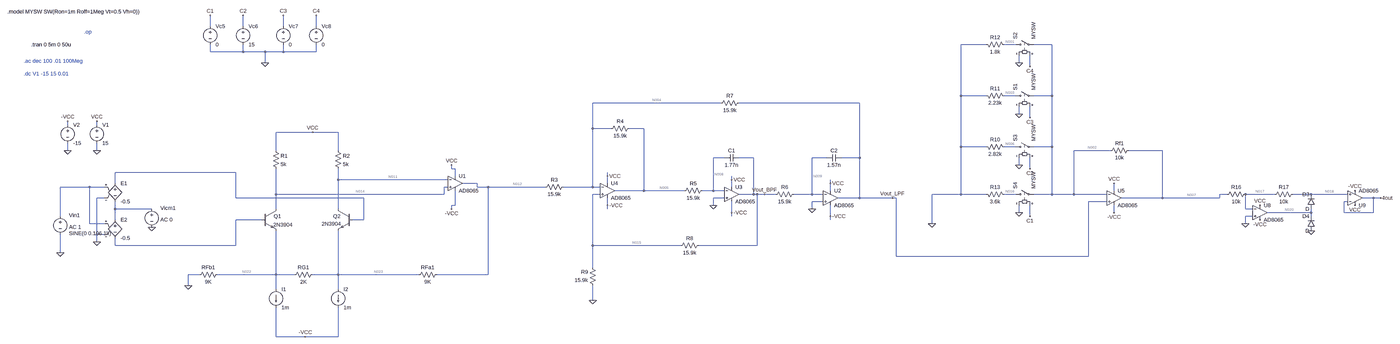
[diagram p0: schematic fullproiect.asc, whole sheet]
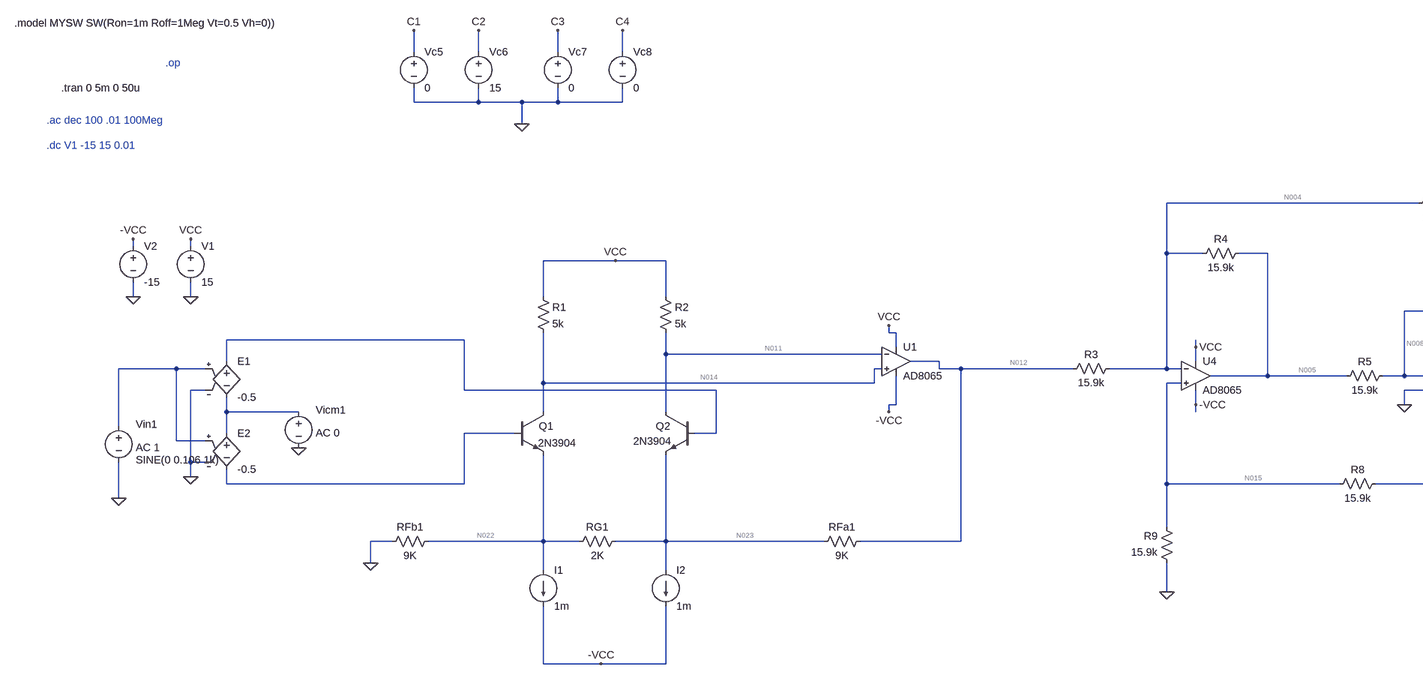
[diagram p1: schematic fullproiect.asc, part, row 1 of 1, column 1 of 2]
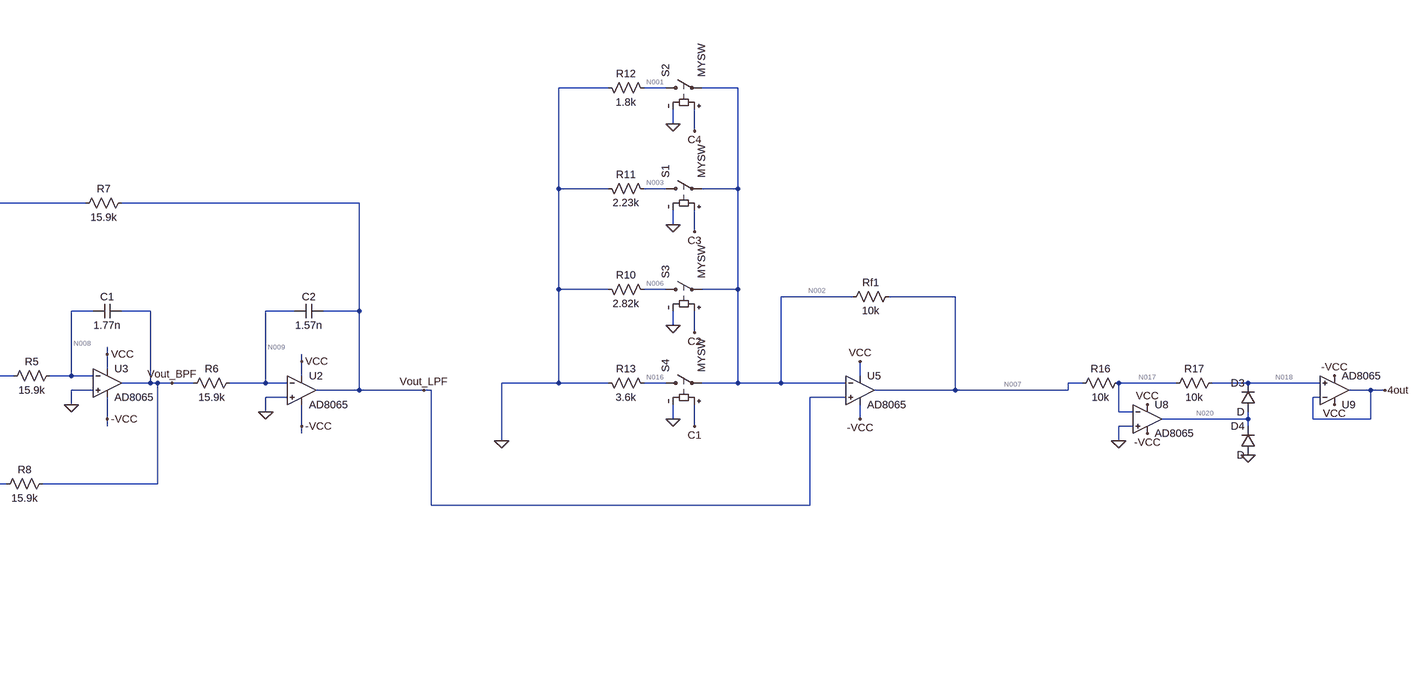
[diagram p2: schematic fullproiect.asc, part, row 1 of 1, column 2 of 2]
fullproiect.asc, the LTspice schematic file:
Version 4
SHEET 1 5496 1652
WIRE -208 -816 -208 -864
WIRE -64 -816 -64 -864
WIRE 112 -816 112 -864
WIRE 256 -816 256 -864
WIRE 3504 -736 3376 -736
WIRE 3632 -736 3584 -736
WIRE 3792 -736 3712 -736
WIRE -208 -704 -208 -736
WIRE -64 -704 -64 -736
WIRE -64 -704 -208 -704
WIRE 32 -704 -64 -704
WIRE 112 -704 112 -736
WIRE 112 -704 32 -704
WIRE 256 -704 256 -736
WIRE 256 -704 112 -704
WIRE 32 -656 32 -704
WIRE 3648 -656 3648 -688
WIRE 3696 -640 3696 -688
WIRE 3376 -512 3376 -736
WIRE 3504 -512 3376 -512
WIRE 3632 -512 3584 -512
WIRE 3792 -512 3792 -736
WIRE 3792 -512 3712 -512
WIRE 2176 -480 1616 -480
WIRE 2784 -480 2256 -480
WIRE 3648 -432 3648 -464
WIRE 3696 -416 3696 -464
WIRE -832 -384 -832 -400
WIRE -704 -384 -704 -400
WIRE 1616 -368 1616 -480
WIRE 1696 -368 1616 -368
WIRE 1840 -368 1776 -368
WIRE 240 -352 80 -352
WIRE 352 -352 240 -352
WIRE 3376 -288 3376 -512
WIRE 3504 -288 3376 -288
WIRE 3632 -288 3584 -288
WIRE 3792 -288 3792 -512
WIRE 3792 -288 3712 -288
WIRE -832 -272 -832 -304
WIRE -704 -272 -704 -304
WIRE 80 -272 80 -352
WIRE 352 -272 352 -352
WIRE 4048 -272 3888 -272
WIRE 4304 -272 4128 -272
WIRE 2192 -240 2144 -240
WIRE 2320 -240 2256 -240
WIRE 2640 -240 2576 -240
WIRE 2784 -240 2784 -480
WIRE 2784 -240 2704 -240
WIRE 3648 -208 3648 -240
WIRE 848 -192 848 -208
WIRE 864 -192 848 -192
WIRE 3696 -192 3696 -240
WIRE -96 -176 -624 -176
WIRE 864 -160 864 -192
WIRE 1680 -160 1680 -176
WIRE 352 -144 352 -192
WIRE 832 -144 352 -144
WIRE 2224 -144 2224 -160
WIRE -624 -128 -624 -176
WIRE 960 -128 896 -128
WIRE 1680 -128 1680 -160
WIRE 2656 -128 2656 -144
WIRE -736 -112 -864 -112
WIRE -672 -112 -736 -112
WIRE 832 -112 816 -112
WIRE 960 -112 960 -128
WIRE 1008 -112 960 -112
WIRE 1408 -112 1008 -112
WIRE 1616 -112 1616 -368
WIRE 1616 -112 1488 -112
WIRE 1648 -112 1616 -112
WIRE 2224 -112 2224 -144
WIRE 1840 -96 1840 -368
WIRE 1840 -96 1712 -96
WIRE 2016 -96 1840 -96
WIRE 2144 -96 2144 -240
WIRE 2144 -96 2096 -96
WIRE 2192 -96 2144 -96
WIRE 2656 -96 2656 -128
WIRE 4064 -96 4064 -128
WIRE 80 -80 80 -192
WIRE 816 -80 816 -112
WIRE 816 -80 80 -80
WIRE 1648 -80 1616 -80
WIRE 2320 -80 2320 -240
WIRE 2320 -80 2256 -80
WIRE 2336 -80 2320 -80
WIRE 2368 -80 2336 -80
WIRE 2416 -80 2368 -80
WIRE 2576 -80 2576 -240
WIRE 2576 -80 2496 -80
WIRE 2624 -80 2576 -80
WIRE 3376 -80 3376 -288
WIRE 3376 -80 3232 -80
WIRE 3504 -80 3376 -80
WIRE 3632 -80 3584 -80
WIRE 3792 -80 3792 -288
WIRE 3792 -80 3712 -80
WIRE 3888 -80 3888 -272
WIRE 3888 -80 3792 -80
WIRE 4032 -80 3888 -80
WIRE 4752 -80 4720 -80
WIRE 4960 -80 4832 -80
WIRE 5120 -80 5040 -80
WIRE 5280 -80 5120 -80
WIRE -672 -64 -704 -64
WIRE -96 -64 -96 -176
WIRE 464 -64 -96 -64
WIRE 2192 -64 2144 -64
WIRE 2784 -64 2784 -240
WIRE 2784 -64 2688 -64
WIRE 2928 -64 2784 -64
WIRE 2944 -64 2928 -64
WIRE 4304 -64 4304 -272
WIRE 4304 -64 4096 -64
WIRE 4720 -64 4720 -80
WIRE 4720 -64 4304 -64
WIRE 5392 -64 5344 -64
WIRE 5424 -64 5392 -64
WIRE 2624 -48 2576 -48
WIRE 4032 -48 3952 -48
WIRE 5280 -48 5264 -48
WIRE 864 -32 864 -96
WIRE 864 -32 848 -32
WIRE 1680 -32 1680 -64
WIRE 2144 -32 2144 -64
WIRE -624 -16 -624 -48
WIRE -464 -16 -624 -16
WIRE 80 -16 80 -80
WIRE 352 -16 352 -144
WIRE 848 -16 848 -32
WIRE 1680 -16 1680 -32
WIRE 2576 -16 2576 -48
WIRE 4832 -16 4832 -80
WIRE 4864 -16 4832 -16
WIRE 2224 0 2224 -48
WIRE 3648 0 3648 -32
WIRE 4064 0 4064 -32
WIRE 5120 0 5120 -16
WIRE 5120 0 4928 0
WIRE 5264 0 5264 -48
WIRE 5392 0 5392 -64
WIRE 5392 0 5264 0
WIRE -864 16 -864 -112
WIRE 2224 16 2224 0
WIRE 2656 16 2656 -32
WIRE 3696 16 3696 -32
WIRE 4864 16 4832 16
WIRE 5120 16 5120 0
WIRE -624 32 -624 -16
WIRE 16 32 -96 32
WIRE 464 32 464 -64
WIRE 464 32 416 32
WIRE 2656 32 2656 16
WIRE -736 48 -736 -112
WIRE -672 48 -736 48
WIRE 3232 48 3232 -80
WIRE 4832 48 4832 16
WIRE -704 96 -704 -64
WIRE -672 96 -704 96
WIRE -704 128 -704 96
WIRE -624 144 -624 112
WIRE -96 144 -96 32
WIRE -96 144 -624 144
WIRE 1616 144 1616 -80
WIRE 2000 144 1616 144
WIRE 2336 144 2336 -80
WIRE 2336 144 2080 144
WIRE -864 176 -864 96
WIRE 2944 192 2944 -64
WIRE 3952 192 3952 -48
WIRE 3952 192 2944 192
WIRE 1616 240 1616 144
WIRE -256 272 -304 272
WIRE 80 272 80 80
WIRE 80 272 -176 272
WIRE 160 272 80 272
WIRE 352 272 352 80
WIRE 352 272 240 272
WIRE 704 272 352 272
WIRE 1008 272 1008 -112
WIRE 1008 272 784 272
WIRE -304 320 -304 272
WIRE 80 336 80 272
WIRE 352 336 352 272
WIRE 1616 384 1616 320
WIRE 80 544 80 416
WIRE 208 544 80 544
WIRE 352 544 352 416
WIRE 352 544 208 544
FLAG -704 -272 0
FLAG -704 -400 VCC
FLAG -832 -272 0
FLAG -832 -400 -VCC
FLAG 848 -208 VCC
FLAG 848 -16 -VCC
FLAG 240 -352 VCC
FLAG -304 320 0
FLAG 208 544 -VCC
FLAG -864 176 0
FLAG -704 128 0
FLAG -464 64 0
FLAG 1616 384 0
FLAG 2144 -32 0
FLAG 2576 -16 0
FLAG 1680 -160 VCC
FLAG 2224 -144 VCC
FLAG 2656 -128 VCC
FLAG 1680 -32 -VCC
FLAG 2224 0 -VCC
FLAG 2656 16 -VCC
FLAG 2928 -64 Vout_LPF
FLAG 2368 -80 Vout_BPF
FLAG 3232 48 0
FLAG 4064 0 -VCC
FLAG 4064 -128 VCC
FLAG 3648 -656 0
FLAG 3648 -432 0
FLAG 3648 -208 0
FLAG 3648 0 0
FLAG 3696 16 C1
FLAG 3696 -192 C2
FLAG 3696 -416 C3
FLAG 3696 -640 C4
FLAG -208 -864 C1
FLAG -64 -864 C2
FLAG 112 -864 C3
FLAG 256 -864 C4
FLAG 32 -656 0
FLAG 4832 48 0
FLAG 5120 80 0
FLAG 4896 -32 VCC
FLAG 5312 -96 -VCC
FLAG 4896 32 -VCC
FLAG 5312 -32 VCC
FLAG 5424 -64 4out
DATAFLAG 80 -144 ""
DATAFLAG 352 -160 ""
DATAFLAG 80 224 ""
DATAFLAG 352 192 ""
DATAFLAG 1008 0 ""
SYMBOL voltage -704 -400 R0
WINDOW 123 0 0 Left 2
WINDOW 39 0 0 Left 2
SYMATTR InstName V1
SYMATTR Value 15
SYMBOL voltage -832 -400 R0
WINDOW 123 0 0 Left 2
WINDOW 39 0 0 Left 2
SYMATTR InstName V2
SYMATTR Value -15
SYMBOL npn 16 -16 R0
WINDOW 0 54 32 Left 2
WINDOW 3 52 69 Left 2
SYMATTR InstName Q1
SYMATTR Value 2N3904
SYMBOL npn 416 -16 M0
WINDOW 0 54 32 Left 2
WINDOW 3 51 65 Left 2
SYMATTR InstName Q2
SYMATTR Value 2N3904
SYMBOL res 64 -288 R0
SYMATTR InstName R1
SYMATTR Value 5k
SYMBOL res 336 -288 R0
SYMATTR InstName R2
SYMATTR Value 5k
SYMBOL res 800 256 R90
WINDOW 0 0 56 VBottom 2
WINDOW 3 32 56 VTop 2
SYMATTR InstName RFa1
SYMATTR Value 9K
SYMBOL res 256 256 R90
WINDOW 0 0 56 VBottom 2
WINDOW 3 32 56 VTop 2
SYMATTR InstName RG1
SYMATTR Value 2K
SYMBOL res -160 256 R90
WINDOW 0 0 56 VBottom 2
WINDOW 3 32 56 VTop 2
SYMATTR InstName RFb1
SYMATTR Value 9K
SYMBOL current 80 336 R0
WINDOW 123 0 0 Left 0
WINDOW 39 0 0 Left 0
SYMATTR InstName I1
SYMATTR Value 1m
SYMBOL current 352 336 R0
WINDOW 123 0 0 Left 0
WINDOW 39 0 0 Left 0
SYMATTR InstName I2
SYMATTR Value 1m
SYMBOL voltage -864 0 R0
WINDOW 123 38 63 Left 2
WINDOW 39 0 0 Left 2
WINDOW 0 38 12 Left 2
WINDOW 3 38 91 Left 2
SYMATTR Value2 AC 1
SYMATTR InstName Vin1
SYMATTR Value SINE(0 0.106 1k)
SYMBOL e -624 -144 R0
SYMATTR InstName E1
SYMATTR Value -0.5
SYMBOL e -624 16 R0
SYMATTR InstName E2
SYMATTR Value -0.5
SYMBOL voltage -464 -32 R0
WINDOW 123 38 63 Left 2
WINDOW 39 0 0 Left 2
WINDOW 0 38 12 Left 2
WINDOW 3 -188 38 Left 2
SYMATTR Value2 AC 0
SYMATTR InstName Vicm1
SYMATTR Value ""
SYMBOL OpAmps\\AD8065 864 -192 R0
SYMATTR InstName U1
SYMBOL res 1504 -128 R90
WINDOW 0 0 56 VBottom 2
WINDOW 3 32 56 VTop 2
SYMATTR InstName R3
SYMATTR Value 15.9k
SYMBOL res 1792 -384 R90
WINDOW 0 0 56 VBottom 2
WINDOW 3 32 56 VTop 2
SYMATTR InstName R4
SYMATTR Value 15.9k
SYMBOL res 2112 -112 R90
WINDOW 0 0 56 VBottom 2
WINDOW 3 32 56 VTop 2
SYMATTR InstName R5
SYMATTR Value 15.9k
SYMBOL res 2512 -96 R90
WINDOW 0 0 56 VBottom 2
WINDOW 3 32 56 VTop 2
SYMATTR InstName R6
SYMATTR Value 15.9k
SYMBOL cap 2256 -256 R90
WINDOW 0 0 32 VBottom 2
WINDOW 3 32 32 VTop 2
SYMATTR InstName C1
SYMATTR Value 1.77n
SYMBOL res 2272 -496 R90
WINDOW 0 0 56 VBottom 2
WINDOW 3 32 56 VTop 2
SYMATTR InstName R7
SYMATTR Value 15.9k
SYMBOL cap 2704 -256 R90
WINDOW 0 0 32 VBottom 2
WINDOW 3 32 32 VTop 2
SYMATTR InstName C2
SYMATTR Value 1.57n
SYMBOL res 2096 128 R90
WINDOW 0 0 56 VBottom 2
WINDOW 3 32 56 VTop 2
SYMATTR InstName R8
SYMATTR Value 15.9k
SYMBOL res 1632 336 R180
WINDOW 0 36 76 Left 2
WINDOW 3 36 40 Left 2
SYMATTR InstName R9
SYMATTR Value 15.9k
SYMBOL OpAmps\\AD8065 2656 -128 R0
SYMATTR InstName U2
SYMBOL OpAmps\\AD8065 2224 -144 R0
SYMATTR InstName U3
SYMBOL OpAmps\\AD8065 1680 -160 R0
SYMATTR InstName U4
SYMBOL res 3488 -304 M90
WINDOW 0 0 56 VBottom 2
WINDOW 3 32 56 VTop 2
SYMATTR InstName R10
SYMATTR Value 2.82k
SYMBOL res 4144 -288 R90
WINDOW 0 0 56 VBottom 2
WINDOW 3 32 56 VTop 2
SYMATTR InstName Rf1
SYMATTR Value 10k
SYMBOL res 3488 -528 M90
WINDOW 0 0 56 VBottom 2
WINDOW 3 32 56 VTop 2
SYMATTR InstName R11
SYMATTR Value 2.23k
SYMBOL res 3488 -752 M90
WINDOW 0 0 56 VBottom 2
WINDOW 3 32 56 VTop 2
SYMATTR InstName R12
SYMATTR Value 1.8k
SYMBOL res 3488 -96 M90
WINDOW 0 0 56 VBottom 2
WINDOW 3 32 56 VTop 2
SYMATTR InstName R13
SYMATTR Value 3.6k
SYMBOL OpAmps\\AD8065 4064 -128 R0
SYMATTR InstName U5
SYMBOL sw 3616 -512 R270
SYMATTR InstName S1
SYMATTR Value MYSW
SYMBOL sw 3616 -736 R270
SYMATTR InstName S2
SYMATTR Value MYSW
SYMBOL sw 3616 -288 R270
SYMATTR InstName S3
SYMATTR Value MYSW
SYMBOL sw 3616 -80 R270
SYMATTR InstName S4
SYMATTR Value MYSW
SYMBOL voltage -208 -832 R0
WINDOW 123 0 0 Left 2
WINDOW 39 0 0 Left 2
SYMATTR InstName Vc5
SYMATTR Value 0
SYMBOL voltage -64 -832 R0
WINDOW 123 0 0 Left 2
WINDOW 39 0 0 Left 2
SYMATTR InstName Vc6
SYMATTR Value 15
SYMBOL voltage 112 -832 R0
WINDOW 123 0 0 Left 2
WINDOW 39 0 0 Left 2
SYMATTR InstName Vc7
SYMATTR Value 0
SYMBOL voltage 256 -832 R0
WINDOW 123 0 0 Left 2
WINDOW 39 0 0 Left 2
SYMATTR InstName Vc8
SYMATTR Value 0
SYMBOL res 4848 -96 R90
WINDOW 0 0 56 VBottom 2
WINDOW 3 32 56 VTop 2
SYMATTR InstName R16
SYMATTR Value 10k
SYMBOL res 5056 -96 R90
WINDOW 0 0 56 VBottom 2
WINDOW 3 32 56 VTop 2
SYMATTR InstName R17
SYMATTR Value 10k
SYMBOL diode 5136 -16 R180
WINDOW 0 24 64 Left 2
WINDOW 3 24 0 Left 2
SYMATTR InstName D3
SYMBOL diode 5136 80 R180
WINDOW 0 24 64 Left 2
WINDOW 3 24 0 Left 2
SYMATTR InstName D4
SYMBOL OpAmps\\AD8065 4896 -64 R0
SYMATTR InstName U8
SYMBOL OpAmps\\AD8065 5312 0 M180
SYMATTR InstName U9
TEXT -760 -792 Left 2 ;.op
TEXT -1096 -880 Left 2 !.model MYSW SW(Ron=1m Roff=1Meg Vt=0.5 Vh=0))
TEXT -992 -736 Left 2 !.tran 0 5m 0 50u
TEXT -1024 -664 Left 2 ;.ac dec 100 .01 100Meg
TEXT -1024 -608 Left 2 ;.dc V1 -15 15 0.01

The netlist it stands for:
* fullproiect.asc
V1 VCC 0 15
V2 -VCC 0 -15
Q1 N014 N021 N022 0 2N3904
Q2 N011 N010 N023 0 2N3904
R1 VCC N014 5k
R2 VCC N011 5k
RFa1 N012 N023 9K
RG1 N023 N022 2K
RFb1 N022 0 9K
I1 N022 -VCC 1m
I2 N023 -VCC 1m
Vin1 N013 0 SINE(0 0.106 1k) AC 1
E1 N010 N019 N013 0 -0.5
E2 N019 N021 N013 0 -0.5
Vicm1 N019 0 AC 0
XU1 N014 N011 VCC -VCC N012 AD8065  ; pins In+ In- V+ V- OUT
R3 N004 N012 15.9k
R4 N005 N004 15.9k
R5 N008 N005 15.9k
R6 N009 Vout_BPF 15.9k
C1 Vout_BPF N008 1.77n
R7 Vout_LPF N004 15.9k
C2 Vout_LPF N009 1.57n
R8 Vout_BPF N015 15.9k
R9 0 N015 15.9k
XU2 0 N009 VCC -VCC Vout_LPF AD8065  ; pins In+ In- V+ V- OUT
XU3 0 N008 VCC -VCC Vout_BPF AD8065  ; pins In+ In- V+ V- OUT
XU4 N015 N004 VCC -VCC N005 AD8065  ; pins In+ In- V+ V- OUT
R10 0 N006 2.82k
Rf1 N007 N002 10k
R11 0 N003 2.23k
R12 0 N001 1.8k
R13 0 N016 3.6k
XU5 Vout_LPF N002 VCC -VCC N007 AD8065  ; pins In+ In- V+ V- OUT
S1 N003 N002 C3 0 MYSW
S2 N001 N002 C4 0 MYSW
S3 N006 N002 C2 0 MYSW
S4 N016 N002 C1 0 MYSW
Vc5 C1 0 0
Vc6 C2 0 15
Vc7 C3 0 0
Vc8 C4 0 0
R16 N017 N007 10k
R17 N018 N017 10k
D3 N020 N018 D
D4 0 N020 D
XU8 0 N017 VCC -VCC N020 AD8065  ; pins In+ In- V+ V- OUT
XU9 N018 4out VCC -VCC 4out AD8065  ; pins In+ In- V+ V- OUT
.model D D
.lib standard.dio
.model NPN NPN
.model PNP PNP
.lib standard.bjt
* .op
.model MYSW SW(Ron=1m Roff=1Meg Vt=0.5 Vh=0))
.tran 0 5m 0 50u
* .ac dec 100 .01 100Meg
* .dc V1 -15 15 0.01
.backanno
.end

* Results of the author's LTspice run, read from the files saved beside the schematic
* Operating Point, zero values left out:
*   V(vcc) = 15 V
*   V(-vcc) = -15 V
*   V(n014) = 10.38 V
*   V(n022) = -650.7 mV
*   V(n011) = 10.38 V
*   V(n023) = -650.8 mV
*   V(n012) = -743.9 µV
*   V(n004) = -600 µV
*   V(n005) = -400 µV
*   V(n008) = -400 µV
*   V(n009) = -400 µV
*   V(vout_bpf) = -400 µV
*   V(vout_lpf) = -656.1 µV
*   V(n015) = -200 µV
*   V(n006) = -1.056 mV
*   V(n007) = -4.833 mV
*   V(n002) = -1.056 mV
*   V(n003) = -2.35 µV
*   V(n001) = -1.898 µV
*   V(n016) = -3.788 µV
*   V(c2) = 15 V
*   V(n017) = -401 µV
*   V(n018) = 4.031 mV
*   V(n020) = 459.4 mV
*   V(4out) = 3.631 mV
*   Ic(Q1) = 924.9 µA
*   Ib(Q1) = 2.799 µA
*   Ie(Q1) = -927.7 µA
*   Ic(Q2) = 925 µA
*   Ib(Q2) = 2.799 µA
*   Ie(Q2) = -927.8 µA
*   I(D3) = 443.2 nA
*   I(I1) = 1 mA
*   I(I2) = 1 mA
*   I(R1) = 924.9 µA
*   I(R2) = 925 µA
*   I(Rfa1) = 72.22 µA
*   I(Rg1) = -1.171 nA
*   I(Rfb1) = -72.31 µA
*   I(R3) = 9.048 nA
*   I(R4) = 12.58 nA
*   I(R5) = 1.04 pA
*   I(R6) = 1.04 pA
*   I(R7) = -3.53 nA
*   I(R8) = -12.58 nA
*   I(R9) = 12.58 nA
*   I(R10) = 374.5 nA
*   I(Rf1) = -377.7 nA
*   I(R11) = 1.054 nA
*   I(R12) = 1.054 nA
*   I(R13) = 1.052 nA
*   I(R16) = 443.2 nA
*   I(R17) = 443.2 nA
*   I(S1) = -1.054 nA
*   I(S2) = -1.054 nA
*   I(S3) = -374.5 nA
*   I(S4) = -1.052 nA
*   I(E1) = -2.799 µA
*   I(E2) = 2.799 µA
*   I(V1) = -46.73 mA
*   I(V2) = 46.81 mA
*   I(Vicm1) = -5.598 µA
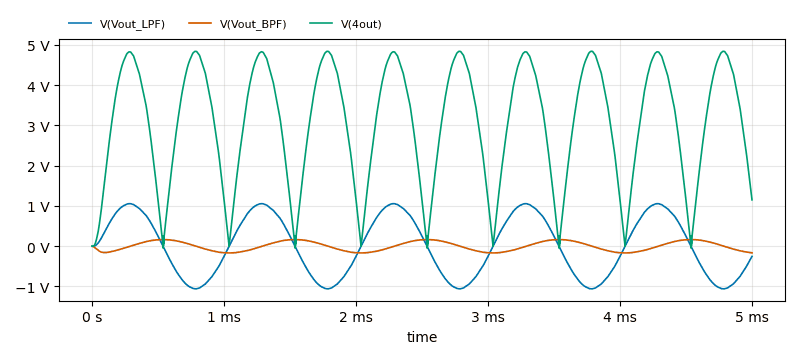
[diagram p3: Transient Analysis of fullproiect.asc, plotted from the saved traces]
* Transient Analysis, 1 run:
*   V(Vout_LPF): min -1.058 V, max 1.057 V, average 866.7 µV, rms 742.9 mV, last -251.3 mV
*   V(Vout_BPF): min -166.7 mV, max 165.8 mV, average 1.045 mV, rms 116.3 mV, last -163 mV
*   V(4out): min -48.25 mV, max 4.843 V, average 3.049 V, rms 3.397 V, last 1.151 V